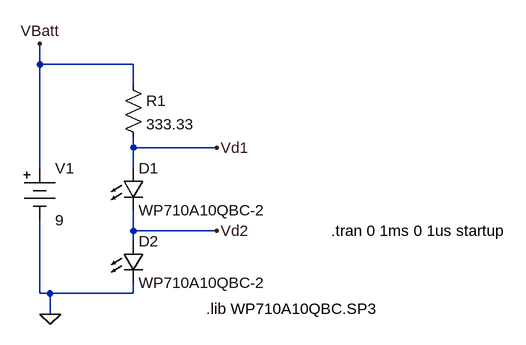
[diagram p0: schematic Untitled.asc]
Untitled.asc, the LTspice schematic file:
Version 4
SHEET 1 1016 680
WIRE 288 144 288 112
WIRE 432 144 288 144
WIRE 432 176 432 144
WIRE 432 272 432 256
WIRE 560 272 432 272
WIRE 288 304 288 144
WIRE 432 304 432 272
WIRE 432 400 432 368
WIRE 560 400 432 400
WIRE 432 416 432 400
WIRE 288 496 288 384
WIRE 304 496 288 496
WIRE 432 496 432 480
WIRE 432 496 304 496
WIRE 304 528 304 496
FLAG 304 528 0
FLAG 288 112 VBatt
FLAG 560 272 Vd1
FLAG 560 400 Vd2
SYMBOL Misc/battery 288 288 R0
SYMATTR InstName V1
SYMATTR Value 9
SYMBOL res 416 160 R0
SYMATTR InstName R1
SYMATTR Value 333.33
SYMBOL LED 416 304 R0
SYMATTR InstName D1
SYMATTR Value WP710A10QBC-2
SYMBOL LED 416 416 R0
SYMATTR InstName D2
SYMATTR Value WP710A10QBC-2
TEXT 544 520 Left 2 !.lib WP710A10QBC.SP3
TEXT 736 400 Left 2 !.tran 0 1ms 0 1us startup

The netlist it stands for:
* Untitled.asc
V1 VBatt 0 9
R1 VBatt Vd1 333.33
D1 Vd1 Vd2 WP710A10QBC-2
D2 Vd2 0 WP710A10QBC-2
.model D D
.lib standard.dio
.lib WP710A10QBC.SP3
.tran 0 1ms 0 1us startup
.backanno
.end